# Altium schematic sheet Esquematico1.schdoc
size 321 x 267 mm
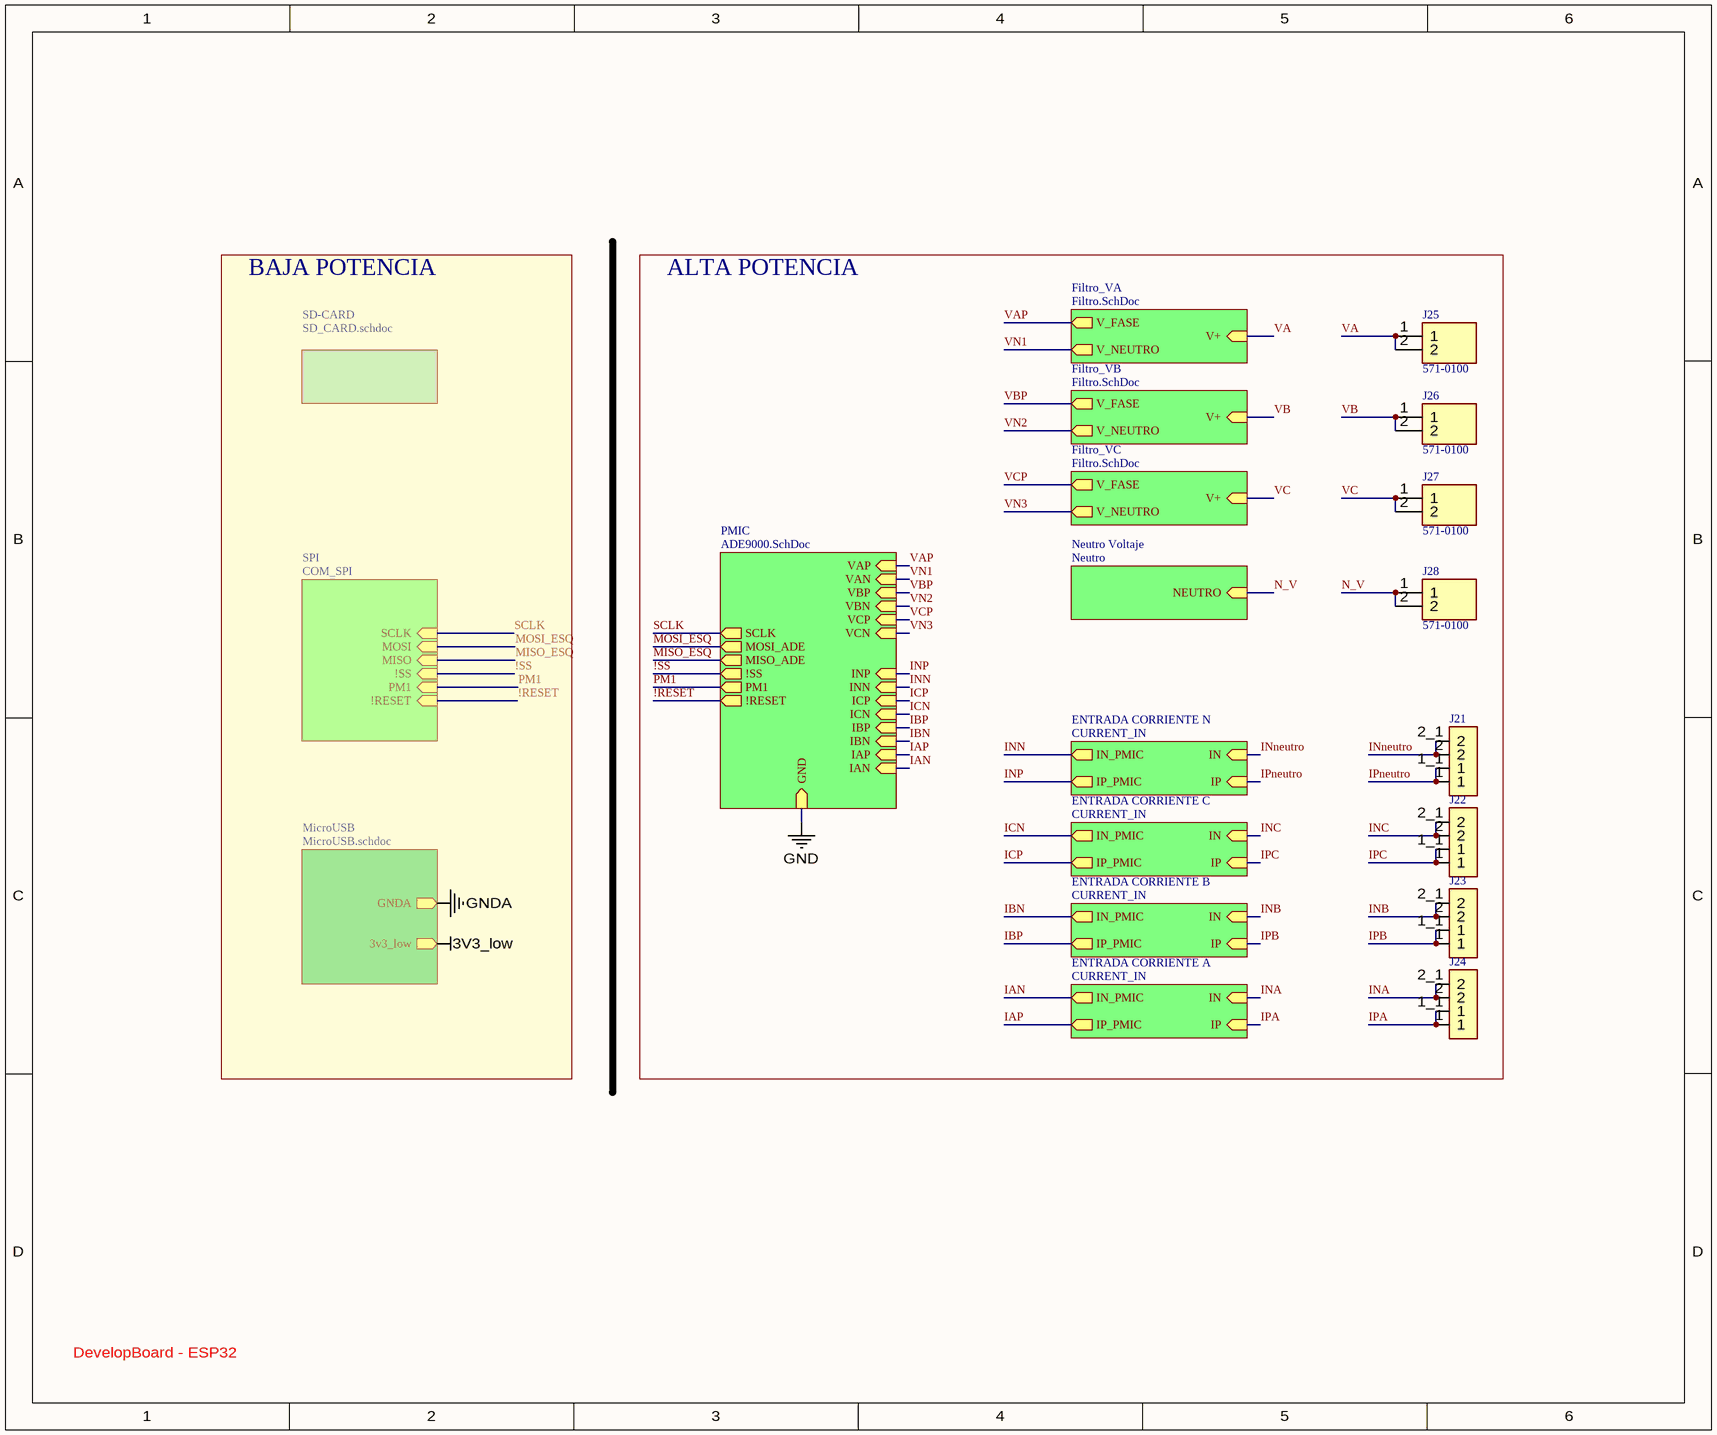
[diagram p0: Esquematico1.schdoc]

## Parts
J21  2834082-1  [TE_2834082-1]  (value not drawn)
J22  2834082-1  [TE_2834082-1]  (value not drawn)
J23  2834082-1  [TE_2834082-1]  (value not drawn)
J24  2834082-1  [TE_2834082-1]  (value not drawn)
J25  571-0100  [5710100]
J26  571-0100  [5710100]
J27  571-0100  [5710100]
J28  571-0100  [5710100]

## Blocks framed on the sheet
ALTA POTENCIA: J21-J28

## Sub-sheets
ENTRADA CORRIENTE A = CURRENT_IN: IN (in), IP_PMIC (out), IP (in), IN_PMIC (out)
ENTRADA CORRIENTE B = CURRENT_IN: IN (in), IP_PMIC (out), IP (in), IN_PMIC (out)
ENTRADA CORRIENTE C = CURRENT_IN: IN (in), IP_PMIC (out), IP (in), IN_PMIC (out)
ENTRADA CORRIENTE N = CURRENT_IN: IN (in), IP_PMIC (out), IP (in), IN_PMIC (out)
Filtro_VA = Filtro.SchDoc: V+ (in), V_NEUTRO (out), V_FASE (out)
Filtro_VB = Filtro.SchDoc: V+ (in), V_NEUTRO (out), V_FASE (out)
Filtro_VC = Filtro.SchDoc: V+ (in), V_NEUTRO (out), V_FASE (out)
MicroUSB = MicroUSB.schdoc: GNDA (out), 3v3_low (out)
Neutro Voltaje = Neutro: NEUTRO (in)
PMIC = ADE9000.SchDoc: SCLK (out), PM1 (out), IBP (in), IBN (in), IAP (in), ICP (in), ICN (in), INP (in), INN (in), VAN (in), VAP (in), VBN (in), VBP (in), VCP (in), VCN (in), !RESET (out), !SS (out), IAN (in), GND (in), MISO_ADE (out), MOSI_ADE (out)
SD-CARD = SD_CARD.schdoc: no entries
SPI = COM_SPI: !RESET (in), PM1 (in), !SS (in), MISO (in), MOSI (in), SCLK (in)

## Nets
3V3_low: sheet MicroUSB/3v3_low
GND: sheet PMIC/GND
GNDA: sheet MicroUSB/GNDA
!RESET: sheet PMIC/!RESET, sheet SPI/!RESET
!SS: sheet PMIC/!SS, sheet SPI/!SS
IAN: sheet PMIC/IAN, sheet ENTRADA CORRIENTE A/IN_PMIC
IAP: sheet PMIC/IAP, sheet ENTRADA CORRIENTE A/IP_PMIC
IBN: sheet PMIC/IBN, sheet ENTRADA CORRIENTE B/IN_PMIC
IBP: sheet PMIC/IBP, sheet ENTRADA CORRIENTE B/IP_PMIC
ICN: sheet PMIC/ICN, sheet ENTRADA CORRIENTE C/IN_PMIC
ICP: sheet PMIC/ICP, sheet ENTRADA CORRIENTE C/IP_PMIC
INA: J24.2 J24.2_1(2) ; sheet ENTRADA CORRIENTE A/IN
INB: J23.2 J23.2_1(2) ; sheet ENTRADA CORRIENTE B/IN
INC: J22.2 J22.2_1(2) ; sheet ENTRADA CORRIENTE C/IN
INN: sheet PMIC/INN, sheet ENTRADA CORRIENTE N/IN_PMIC
INneutro: J21.2 J21.2_1(2) ; sheet ENTRADA CORRIENTE N/IN
INP: sheet PMIC/INP, sheet ENTRADA CORRIENTE N/IP_PMIC
IPA: J24.1 J24.1_1(1) ; sheet ENTRADA CORRIENTE A/IP
IPB: J23.1 J23.1_1(1) ; sheet ENTRADA CORRIENTE B/IP
IPC: J22.1 J22.1_1(1) ; sheet ENTRADA CORRIENTE C/IP
IPneutro: J21.1 J21.1_1(1) ; sheet ENTRADA CORRIENTE N/IP
MISO_ESQ: sheet PMIC/MISO_ADE, sheet SPI/MISO
MOSI_ESQ: sheet PMIC/MOSI_ADE, sheet SPI/MOSI
N_V: J28.1 J28.2 ; sheet Neutro Voltaje/NEUTRO
PM1: sheet PMIC/PM1, sheet SPI/PM1
SCLK: sheet PMIC/SCLK, sheet SPI/SCLK
VA: J25.1 J25.2 ; sheet Filtro_VA/V+
VAP: sheet Filtro_VA/V_FASE, sheet PMIC/VAP
VB: J26.1 J26.2 ; sheet Filtro_VB/V+
VBP: sheet Filtro_VB/V_FASE, sheet PMIC/VBP
VC: J27.1 J27.2 ; sheet Filtro_VC/V+
VCP: sheet Filtro_VC/V_FASE, sheet PMIC/VCP
VN1: sheet Filtro_VA/V_NEUTRO, sheet PMIC/VAN
VN2: sheet Filtro_VB/V_NEUTRO, sheet PMIC/VBN
VN3: sheet Filtro_VC/V_NEUTRO, sheet PMIC/VCN

## Notes on the sheet
- BAJA POTENCIA
- DevelopBoard - ESP32

## Library data of the parts
J21-J24 = 2834082-1: Conn PC Terminal Block 2 POS 5mm Solder ST Thru-Hole 20A/Contact Box/Carton; MF: TE Connectivity; TE_purchase_URL: https://www.te.com/usa-en/product-2834082-1.html?te_bu=Cor&te_type=disp&te_campaign=seda_glo_cor-seda-global-disp-prtnr-fy19-seda-model-bom-cta_sma-317_1&elqCampaignId=32493; Digi-Key_Part_Number: A124223-ND; Package: None; SnapEDA_Link: https://www.snapeda.com/parts/2834082-1/TE%20Connectivity%20AMP%20Connectors/view-part/2471183/?ref=snap; MP: 2834082-1; Value: *; Digi-Key_Purchase_URL: https://www.digikey.com/product-detail/en/te-connectivity-amp-connectors/2834082-1/A124223-ND/6012670?utm_source=snapeda&utm_medium=aggregator&utm_campaign=symbol; Comment_1: *
J25-J28 = 571-0100: Connector; Manufacturer_Name: Deltron; Datasheet Link: https://www.dem-uk.com/deltron-components/Data/Product_Downloads/deltron-571-0100-4mm-90deg-single-socket-data.pdf; Height: 12.4mm; Manufacturer_Part_Number: 571-0100; Mouser Part Number: 164-6218; Mouser Price/Stock: https://www.mouser.co.uk/ProductDetail/Deltron/571-0100?qs=E2gf03EXmtoqC8%2FBhoPdrg%3D%3D